# Altium schematic sheet Ref.01_Zynq_Power_Config_2.SchDoc
size A2; SheetNumber: 9; SheetTotal: 11
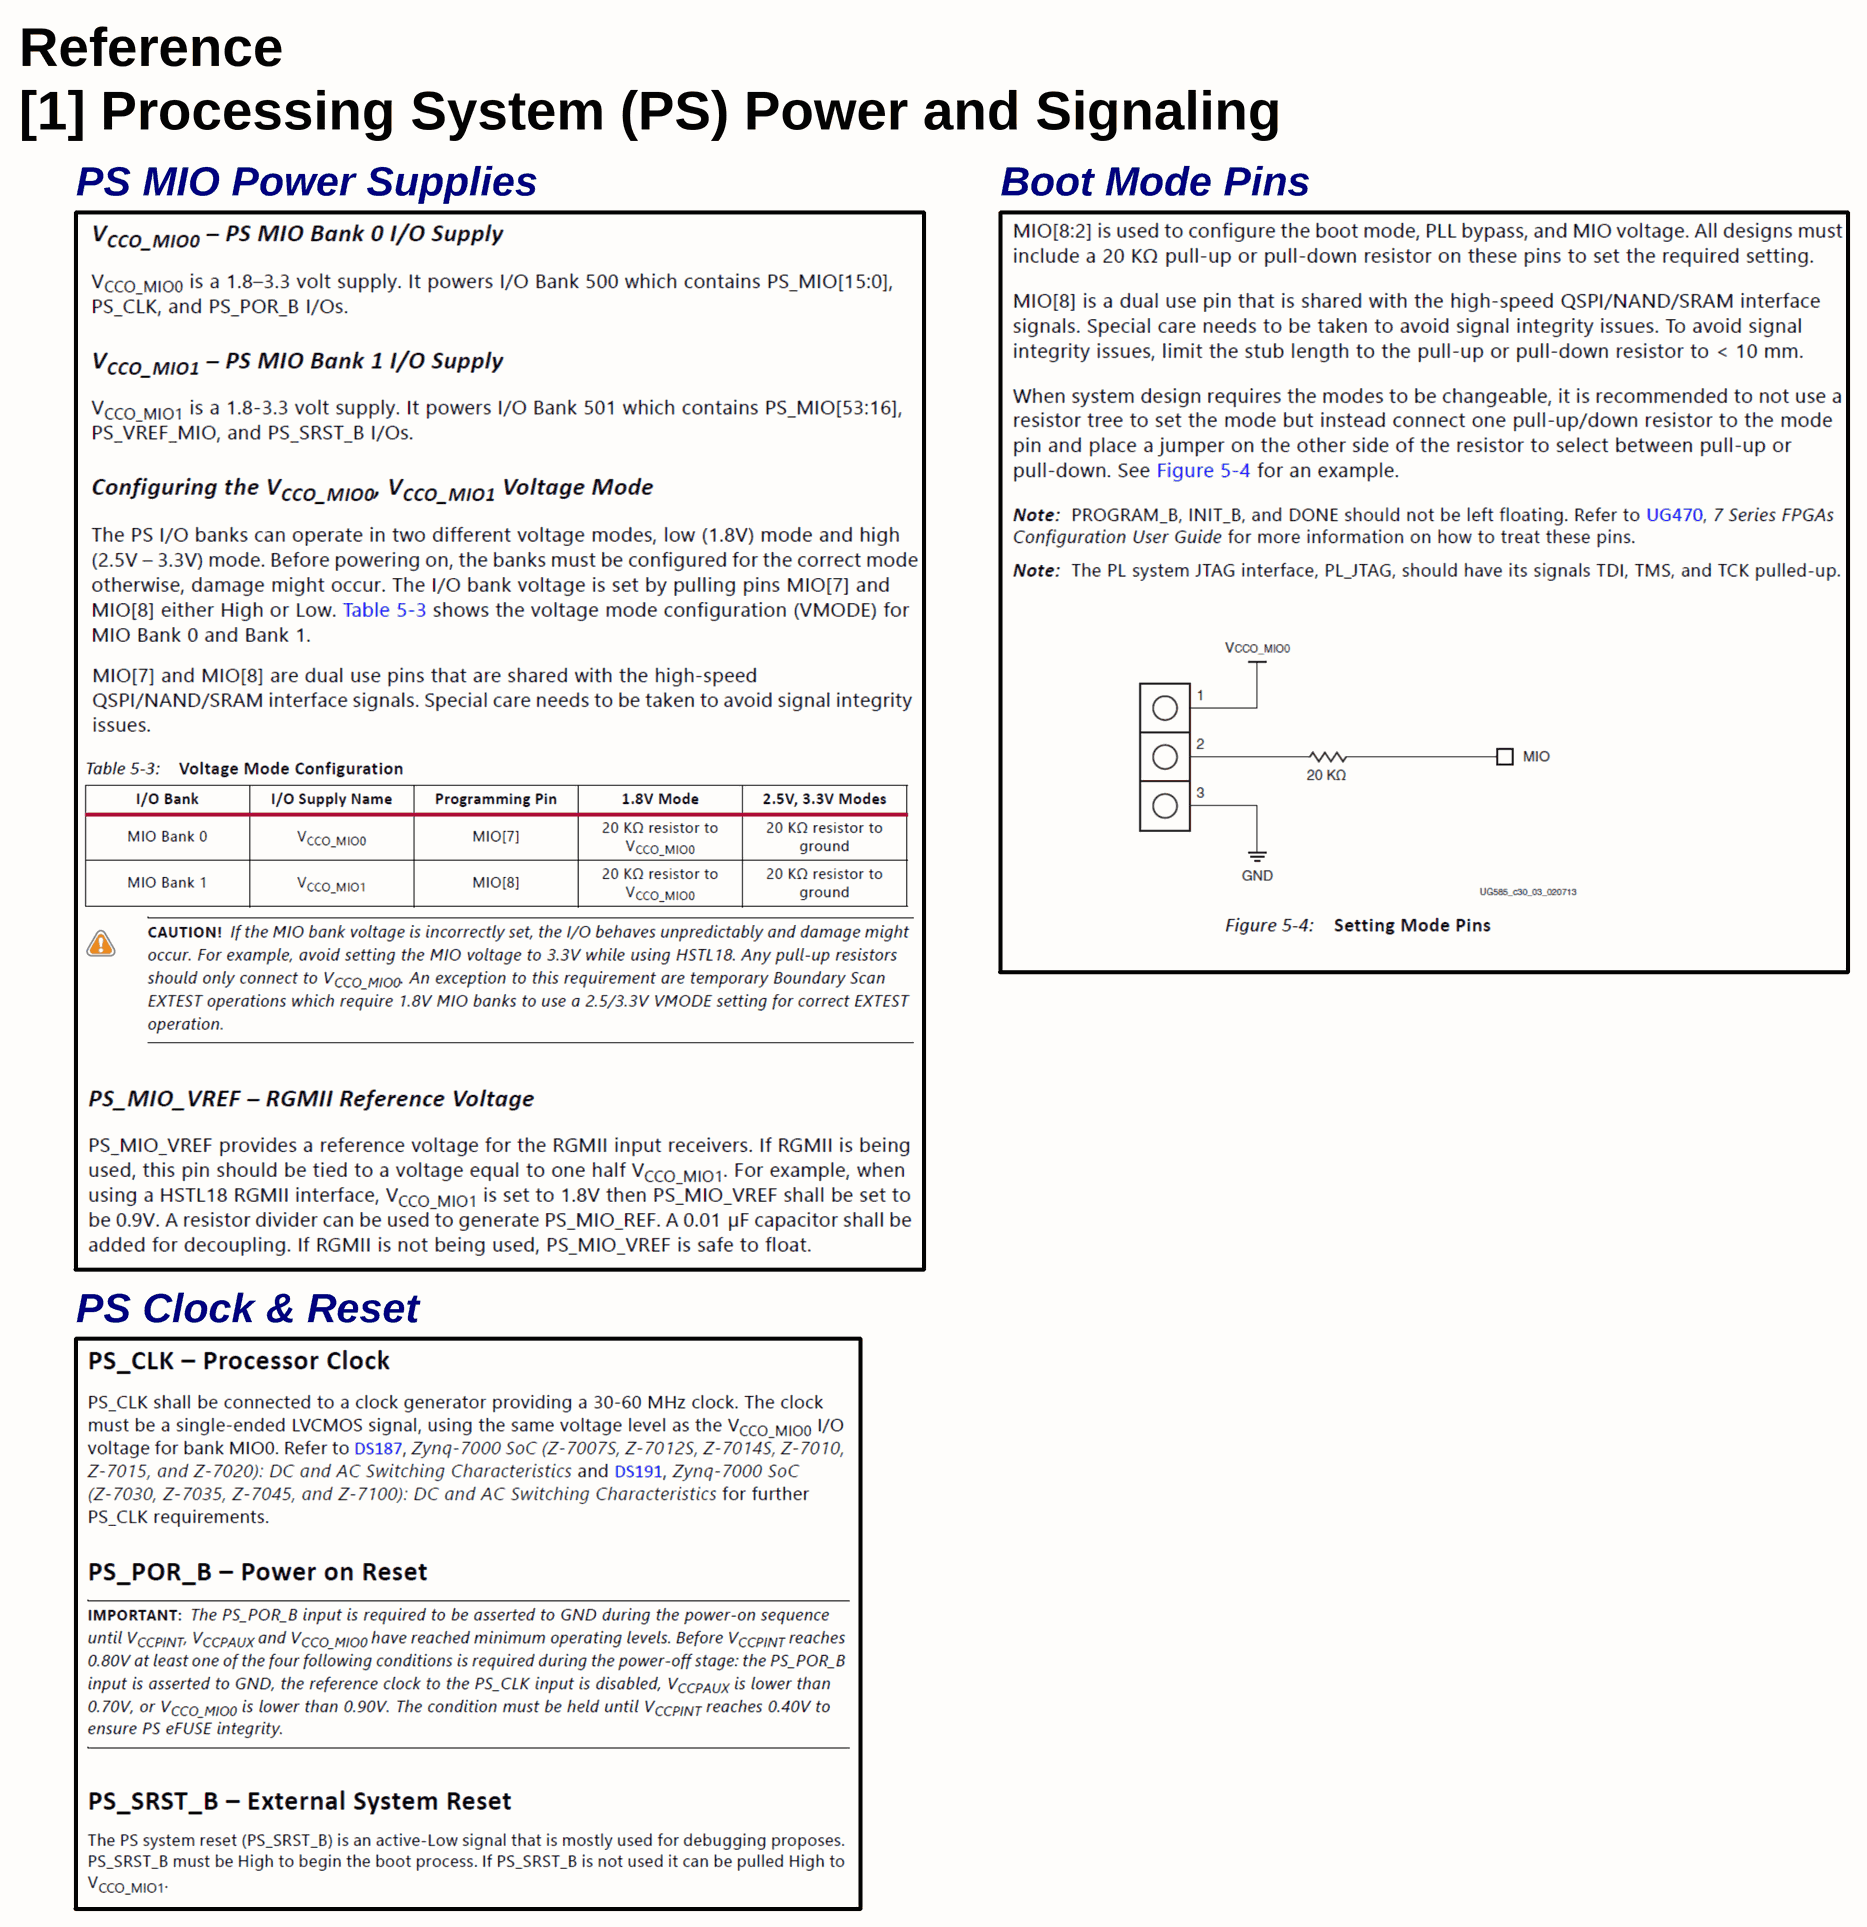
[diagram p0: Ref.01_Zynq_Power_Config_2.SchDoc]

## Notes on the sheet
- Reference
- [1] Processing System (PS) Power and Signaling
- PS MIO Power Supplies
- Boot Mode Pins
- PS Clock & Reset
- Title
- Rev
- Doc
- Sheet #
- of
- Author
- This document is copyright of ArkX and shall not be revealed, produced, copied, in whole or in part,
- Date
- nor used for any purpose other than submitted.